# Altium project Ajax_Project_1.PrjPcb
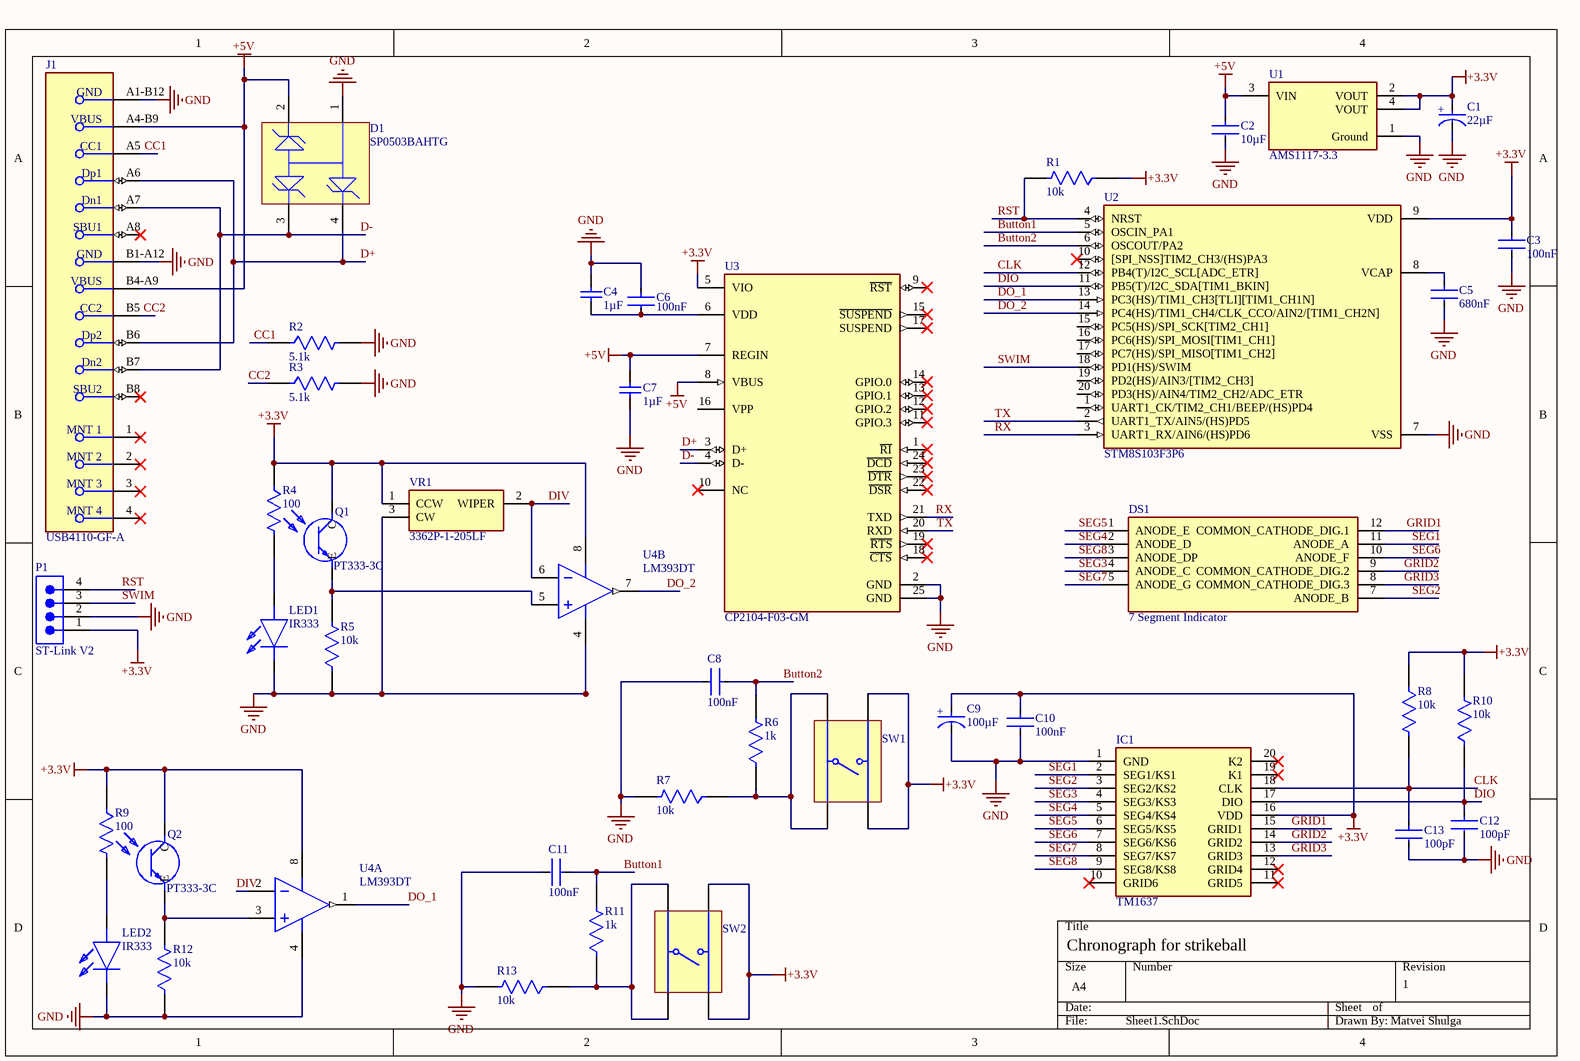
[diagram p0: Sheet1.SchDoc]
1 sheet, 42 parts. Net scope: global (net labels, ports and power ports of the same name join across sheets).

## Sheet Sheet1.SchDoc: Chronograph for strikeball
size A4; Author: Matvei Shulga; Revision: 1; SheetNumber: 1; SheetTotal: 1; SPICEModelCacheOPLTHHRQ: <root> / <DocumentId>OPLTHHRQ</DocumentId> / <CacheFrame Number="0"> / <Model Name="umk316b7104_lht" Kind="CKT"> / <Text>* UMK316B7104_LHT     SPICE MODEL  ( General Type ) / *-------------------------------------------------------------------------------------------------------- / * Model Generated by TAIYO YUDEN Corporation (http://www.ty-top.com) / * Version 1.0 / * TAIYO YUDEN Control No. 170508_121019 / * Copyright(c) 2012 TAIYO YUDEN CO.,LTD. All Rights Reserved. / *-------------------------------------------------------------------------------------------------------- / * / * Products Name : Multilayer Ceramic Capacitors / * / * Characteristics : / *     Capacitance : 0.1 uF , Rated Voltage : 50V , TCC : X7R / *     Case Size : 3.2 x 1.6 / 0.126 x 0.063 [mm/inch] , Thickness : 1.6 / 0.063 [mm/inch] / *     (Conditions: Temperature = 25 degC , DC Bias Current/Voltage = 0A / 0V) / * / * Frequency Range : 40Hz - 3GHz / * / * External Node Assignments : / * / *  1  o---| |---o  2 / * / *-------------------------------------------------------------------------------------------------------- / .SubCkt UMK316B7104_LHT 1 2 / **************************** / C0 1 110 0.095206u / Cm 1 101 4052.8p / C1 101 102 0.015152u / Rc1 101 102 38.136k / C2 102 103 7011.9p / Rc2 102 103 4.5152k / C3 103 110 480.27p / Rc3 103 110 77.842 / C2m 1 301 4187.2p / C21 301 302 0.037007u / Rc21 301 302 210.34k / C22 302 303 0.028314u / Rc22 302 303 194.19k / C23 303 304 0.033221u / Rc23 303 304 121.23k / C24 304 305 0.030298u / Rc24 304 305 5.1398k / C25 305 306 0.022988u / Rc25 305 306 6.4469k / C26 306 307 8382.9p / Rc26 306 307 701.92 / C27 307 308 0.010675u / Rc27 307 308 133.48 / C28 308 309 865.4p / Rc28 308 309 446.19 / C29 309 110 51.562p / Rc29 309 110 115.35 / Rp0 1 110 1G / L0 110 120 0.37263n / Lm 120 130 0.29412n / RL1 120 130 391.15 / L2 120 122 1.582n / RL2 122 130 1.4748 / L3 120 123 2.0038n / RL3 123 130 1.8577 / CR 120 124 0.013158u / LR 124 125 0.41019n / RR 125 130 0.23132 / CL 130 140 10.1p / LL 130 140 0.27868n / RL 130 140 9.6624 / Rs 140 2 17.436m / **************************** / .ends UMK316B7104_LHT</Text> / </Model> / </CacheFrame> / </root>

### Parts
C1  value 22µF  [FP-TAJA-MFG]  (hidden comment: TAJA226M010RNJ)
C2  value 10µF  [FP-GCJ31C-0_4-IPC_C]  (hidden comment: GCJ31CD7YA106KE02L)
C3  value 100nF  [FP-1206-L_3_2_0_15-W_1_6-IPC_B]  (hidden comment: UMK316B7104KLHT)
C4  value 1µF  [CAPC1206(3216)130_M]  (hidden comment: 1206ZC105JAT2A)
C5  value 680nF  [FP-CC0805-0_85-IPC_A]  (hidden comment: CC0805KKX7R6BB684)
C6  value 100nF  [FP-1206-L_3_2_0_15-W_1_6-IPC_B]  (hidden comment: UMK316B7104KLHT)
C7  value 1µF  [CAPC1206(3216)130_M]  (hidden comment: 1206ZC105JAT2A)
C8  value 100nF  [FP-1206-L_3_2_0_15-W_1_6-IPC_B]  (hidden comment: UMK316B7104KLHT)
C9  value 100µF  [FP-TLJA-MFG]  (hidden comment: TLJA107M006R0500)
C10  value 100nF  [FP-1206-L_3_2_0_15-W_1_6-IPC_B]  (hidden comment: UMK316B7104KLHT)
C11  value 100nF  [FP-1206-L_3_2_0_15-W_1_6-IPC_B]  (hidden comment: UMK316B7104KLHT)
C12  value 100pF  [FP-1206-L_3_2_0_2-W_1_6_0-IPC_A]  (hidden comment: 12063A101KAT2A)
C13  value 100pF  [FP-1206-L_3_2_0_2-W_1_6_0-IPC_A]  (hidden comment: 12063A101KAT2A)
D1  SP0503BAHTG  [LFUS-SOT143-4_V]
DS1  7 Segment Indicator  [ELT315USOWAS530A3]
IC1  TM1637  [SOIC127P1045X280-20N]
J1  USB4110-GF-A  [FP-USB4110-GF-A-MFG]
LED1  IR333  [IR333H0A]
LED2  IR333  [IR333H0A]
P1  ST-Link V2  [61300411021]
Q1  PT333-3C  [PT3333C]
Q2  PT333-3C  [PT3333C]
R1  value 10k  [FP-AC1206-IPC_A]  (hidden comment: AC1206FR-1310KL)
R2  value 5.1k  [FP-ESR18-IPC_A]  (hidden comment: ESR18EZPF5101)
R3  value 5.1k  [FP-ESR18-IPC_A]  (hidden comment: ESR18EZPF5101)
R4  value 100  [FP-RC3216-IPC_B]  (hidden comment: RC3216J101CS)
R5  value 10k  [FP-AC1206-IPC_A]  (hidden comment: AC1206FR-1310KL)
R6  value 1k  [FP-RP732B-MFG]  (hidden comment: RP73D2B1K0BTG)
R7  value 10k  [FP-AC1206-IPC_A]  (hidden comment: AC1206FR-1310KL)
R8  value 10k  [FP-AC1206-IPC_A]  (hidden comment: AC1206FR-1310KL)
R9  value 100  [FP-RC3216-IPC_B]  (hidden comment: RC3216J101CS)
R10  value 10k  [FP-AC1206-IPC_A]  (hidden comment: AC1206FR-1310KL)
R11  value 1k  [FP-RP732B-MFG]  (hidden comment: RP73D2B1K0BTG)
R12  value 10k  [FP-AC1206-IPC_A]  (hidden comment: AC1206FR-1310KL)
R13  value 10k  [FP-AC1206-IPC_A]  (hidden comment: AC1206FR-1310KL)
SW1  FSM4JSMATR  [TECO-FSM4JSMATR_V]  (value not drawn)
SW2  FSM4JSMATR  [TECO-FSM4JSMATR_V]  (value not drawn)
U1  AMS1117-3.3  [FP-AMS1117-IPC_B]
U2  STM8S103F3P6  [SOP65P640X120-20N]
U3  CP2104-F03-GM  [FP-CP2104-F03-GM-MFG]
U4  LM393DT  [STM-SO-8_D_L]  (parts A,B of 2)
VR1  3362P-1-205LF  [3362P1205LF]

### Nets
+3.3V: C1.2(A) C3.1 C9.2(A) C10.1 IC1.16(VDD) P1.1 Q1.2(C) Q2.2(C) R1.1 R4.1 R8.1 R9.1 R10.2 SW1.3 SW1.4 SW2.3 SW2.4 U1.2(VOUT) U1.4(VOUT) U2.9(VDD) U3.5(VIO) U4.8(VCC+) VR1.1(CCW)
+5V: C2.1 C7.2 D1.2 J1.A4-B9(VBUS) J1.B4-A9(VBUS) U1.3(VIN) U3.7(REGIN) U3.8(VBUS)
GND: C1.1(C) C2.2 C3.2 C4.2 C5.2 C6.1 C7.1 C8.2 C9.1(C) C10.2 C11.2 C12.2 C13.2 D1.1 IC1.1(GND) J1.A1-B12(GND) J1.B1-A12(GND) LED1.2(K) LED2.2(K) P1.2 R2.2 R3.2 R5.1 R7.2 R12.1 R13.2 U1.1(Ground) U2.7(VSS) U3.2(GND) U3.25(GND) U4.4(VCC-) VR1.3(CW)
Button1: C11.1 R11.2 U2.5(OSCIN_PA1)
Button2: C8.1 R6.2 U2.6(OSCOUT/PA2)
CC1: J1.A5(CC1) R2.1
CC2: J1.B5(CC2) R3.1
CLK: C13.1 IC1.18(CLK) R8.2 U2.12(PB4(T)/I2C_SCL[ADC_ETR])
D+: D1.4 J1.A6(Dp1) J1.B6(Dp2) U3.3(D+)
D-: D1.3 J1.A7(Dn1) J1.B7(Dn2) U3.4(D-)
DIO: C12.1 IC1.17(DIO) R10.1 U2.11(PB5(T)/I2C_SDA[TIM1_BKIN])
DIV: U4.2(IN1-) U4.6(IN2-) VR1.2(WIPER)
DO_1: U2.13(PC3(HS)/TIM1_CH3[TLI][TIM1_CH1N]) U4.1(OUT1)
DO_2: U2.14(PC4(HS)/TIM1_CH4/CLK_CCO/AIN2/[TIM1_CH2N]) U4.7(OUT2)
GRID1: DS1.12(COMMON_CATHODE_DIG.1) IC1.15(GRID1)
GRID2: DS1.9(COMMON_CATHODE_DIG.2) IC1.14(GRID2)
GRID3: DS1.8(COMMON_CATHODE_DIG.3) IC1.13(GRID3)
RST: P1.4 R1.2 U2.4(NRST)
RX: U2.3(UART1_RX/AIN6/(HS)PD6) U3.21(TXD)
SEG1: DS1.11(ANODE_A) IC1.2(SEG1/KS1)
SEG2: DS1.7(ANODE_B) IC1.3(SEG2/KS2)
SEG3: DS1.4(ANODE_C) IC1.4(SEG3/KS3)
SEG4: DS1.2(ANODE_D) IC1.5(SEG4/KS4)
SEG5: DS1.1(ANODE_E) IC1.6(SEG5/KS5)
SEG6: DS1.10(ANODE_F) IC1.7(SEG6/KS6)
SEG7: DS1.5(ANODE_G) IC1.8(SEG7/KS7)
SEG8: DS1.3(ANODE_DP) IC1.9(SEG8/KS8)
SWIM: P1.3 U2.18(PD1(HS)/SWIM)
TX: U2.2(UART1_TX/AIN5/(HS)PD5) U3.20(RXD)
NetC4_1: C4.1 C6.2 U3.6(VDD)
NetC5_1: C5.1 U2.8(VCAP)
NetLED1_1: LED1.1(A) R4.2
NetLED2_1: LED2.1(A) R9.2
NetQ1_1: Q1.1(E) R5.2 U4.5(IN2+)
NetQ2_1: Q2.1(E) R12.2 U4.3(IN1+)
NetR6_1: R6.1 R7.1 SW1.1 SW1.2
NetR11_1: R11.1 R13.1 SW2.1 SW2.2

Not connected (* = marked no-connect by the designer): IC1 10(GRID6)* 11(GRID5)* 12(GRID4)* 19(K1)* 20(K2)*; J1 1(MNT_1)* 2(MNT_2)* 3(MNT_3)* 4(MNT_4)* A8(SBU1)* B8(SBU2)*; U2 1(UART1_CK/TIM2_CH1/BEEP/(HS)PD4) 10([SPI_NSS]TIM2_CH3/(HS)PA3)* 15(PC5(HS)/SPI_SCK[TIM2_CH1]) 16(PC6(HS)/SPI_MOSI[TIM1_CH1]) 17(PC7(HS)/SPI_MISO[TIM1_CH2]) 19(PD2(HS)/AIN3/[TIM2_CH3]) 20(PD3(HS)/AIN4/TIM2_CH2/ADC_ETR); U3 1(~{RI})* 9(~{RST})* 10(NC)* 11(GPIO.3)* 12(GPIO.2)* 13(GPIO.1)* 14(GPIO.0)* 15(~{SUSPEND})* 16(VPP) 17(SUSPEND)* 18(~{CTS})* 19(~{RTS})* 22(~{DSR})* 23(~{DTR})* 24(~{DCD})*

### Notes on the sheet
- (in symbol CMP-001-00089-1) +
- (in symbol CMP-001-00091-1) +

### Library data of the parts
C1 = CMP-001-00089-1: Cap Tant Solid 22uF 10V A CASE 20%( 3.2 X 1.6 X 1.6mm) Inward L SMD 3216-18 3 Ohm 125C T/R; Ripple Current: 63mA; Voltage: 10V; Mounting Technology: Surface Mount; Package: 1206; Pins: 2; Tolerance: 20%; Min Operating Temperature: -55°C; Max Operating Temperature: 125°C
C2 = CMP-001-00085-1: Ceramic Capacitor, Ceramic, 35V, 10% +Tol, 10% -Tol, X7T, 22/-33% TC, 10uF, Surface Mount, 1206; Package: 1206; Mounting Technology: Surface Mount; Min Operating Temperature: -55°C; Voltage: 35V; Max Operating Temperature: 125°C; Tolerance: 10%
C3 C6 C8 C10 C11 = CMP-001-00093-1: Ceramic Capacitor, Multilayer, Ceramic, 50V, 10% +Tol, 10% -Tol, X7R, 15% TC, 0.1uF, Surface Mount, 1206; Pins: 2; Max Operating Temperature: 125°C; RoHS Compliant: Yes; Package: 1206; Capacitor Type: Ceramic; Min Operating Temperature: -55°C; Mounting Technology: Surface Mount
C4 C7 = CMP-001-00084-1: Ceramic Capacitor, Multilayer, Ceramic, 10V, 5% +Tol, 5% -Tol, X7R, 15% TC, 1uF, Surface Mount, 1206; Pins: 2; Mounting Technology: Surface Mount; Min Operating Temperature: -55°C; Package: 1206; Voltage: 10V; Max Operating Temperature: 125°C; Tolerance: 5%
C5 = CMP-001-00094-1: Ceramic Capacitor, Multilayer, Ceramic, 10V, 10% +Tol, 10% -Tol, X7R, 15% TC, 0.68uF, Surface Mount, 0805; Package: 0805; Mounting Technology: Surface Mount; Capacitor Type: Ceramic; Pins: 2; RoHS Compliant: Yes; Max Operating Temperature: 125°C; Min Operating Temperature: -55°C
C9 = CMP-001-00091-1: Cap Tant Solid 100uF 6.3V A CASE 20% (3.2 X 1.6 X 1.6mm) Inward L SMD 3216-18 0.5 Ohm 125C T/R; Ripple Current: 155mA; Mounting Technology: Surface Mount; Package: 1206; Min Operating Temperature: -55°C; Max Operating Temperature: 125°C; Voltage: 6.3V; Tolerance: 20%; Pins: 2
C12 C13 = CMP-001-00096-1: Ceramic Capacitor, Multilayer, Ceramic, 25V, 10% +Tol, 10% -Tol, C0G, 30ppm/Cel TC, 0.0001uF, Surface Mount, 1206; Max Operating Temperature: 125°C; Min Operating Temperature: -55°C; Package: 1206; Pins: 2; Mounting Technology: Surface Mount; RoHS Compliant: Yes; Capacitor Type: Ceramic
D1 = CMP-004-00031-1: SP050xBA Series 8.5 V 30 pF Triple Uni-Directional TVS Avalanche Diode-SOT143-4; Mounting Technology: Surface Mount; Max Operating Temperature: 125°C; Package: SOT-143; Min Operating Temperature: -40°C; Pins: 4
DS1 = ELT-315USOWA_S530-A3: Display; Manufacturer: Everlight; Part Number: ELT-315USOWA/S530-A3; Datasheet Link: https://media.digikey.com/pdf/Data%20Sheets/Everlight%20PDFs/ELT-315USOWA_S530-A3.pdf; Height: 7.45mm
IC1 = TM1637__SOP_: Integrated Circuit; Manufacturer: TITAN MICRO ELECTRONICS; Part Number: TM1637 (SOP); Datasheet Link: https://www.mcielectronics.cl/website_MCI/static/documents/Datasheet_TM1637.pdf; Height: 2.8mm
J1 = CMP-002-00071-1: USB Connector, 16 Contact(s), Male, Right Angle, Surface Mount Terminal, Locking, Receptacle; Voltage: 20V; Pins: 16; Gender: Receptacle; Max Operating Temperature: 85°C; Min Operating Temperature: -40°C
LED1 LED2 = IR333_H0-A: LED; Manufacturer: Everlight; Part Number: IR333/H0-A; Datasheet Link: https://datasheet.lcsc.com/lcsc/1808280419_Everlight-Elec-IR333-H0-A_C264292.pdf; Height: 10.4mm; Mouser Part Number: 638-IR333/H0-A; Mouser Price/Stock: https://www.mouser.co.uk/ProductDetail/Everlight/IR333-H0-A?qs=By6Nw2ByBD39%252BlkBkN%2FobQ%3D%3D
P1 = CMP-007-000000-1: NexarPartId: 31153320; Operating Supply Voltage: 250V; Contact Resistance: 20m?; Gender: Male; Connector Type: Male Pin; Number of Positions: 4; Pitch: 2.54mm; Current Rating: 3A; Mount: Through Hole; Color: Black; REACH SVHC: Unknown; Component Type: Standard; Source: Components - 25.08.25 - 11.48.SchLib; Lead Pitch: 2.54mm; Contact Plating: Gold; Design Item ID: CMP-1502-01063-3; Number of Pins: 4; Contact Material: Copper; Number of Contacts: 4; Termination: Solder; Number of Rows: 1; RoHS: Compliant; Contact Mating Length: 5.9944mm; Pin Count: 4
Q1 Q2 = PT333-3C: Phototransistor; Manufacturer: Everlight; Datasheet Link: https://datasheet.datasheetarchive.com/originals/distributors/Datasheets-3/DSA-51362.pdf; Part Number: PT333-3C; Mouser Part Number: 638-PT3333C; Mouser Price/Stock: https://www.mouser.com/Search/Refine.aspx?Keyword=638-PT3333C; Arrow Part Number: PT333-3C; Arrow Price/Stock: https://www.arrow.com/en/products/pt333-3c/everlight-electronics?region=nac
R1 R5 R7 R8 R10 R12 R13 = CMP-009-00188-1: Res Thick Film 1206 10K Ohm 1% 0.25W(1/4W) ±100ppm/°C Pad SMD T/R Automotive AEC-Q200; Voltage: 200V; Tolerance: 1%; Mounting Technology: Surface Mount; Package: 1206; Max Operating Temperature: 155°C; Min Operating Temperature: -55°C
R2 R3 = CMP-009-00187-1: Res Thick Film 1206 5.1K Ohm 1% 0.5W(1/2W) ±100ppm/C Pad SMD T/R Automotive AEC-Q200; Voltage: 200V; Min Operating Temperature: -55°C; Tolerance: 1%; Mounting Technology: Surface Mount; Max Operating Temperature: 155°C; Package: 1206
R4 R9 = CMP-009-00193-1: Res Thick Film 1206 100 Ohm 5% 1/4W ±100ppm/°C Molded SMD T/R; Voltage: 200V; Tolerance: 5%; Min Operating Temperature: -55°C; Max Operating Temperature: 155°C; Package: 1206; Mounting Technology: Surface Mount
R6 R11 = CMP-009-00192-1: Res Thin Film 1206 1K Ohm 0.1% 0.25W(1/4W) ±15ppm/C Pad SMD Cut Tape Medical; Voltage: 25V; Package: 1206; Mounting Technology: Surface Mount; Min Operating Temperature: -55°C; Max Operating Temperature: 155°C; Pins: 2; Tolerance: 0.1%
SW1 SW2 = CMP-016-00017-1: Keypad Switch, 1 Switches, SPST, Momentary-tactile, 0.05A, 24VDC, 2.06N, Solder Terminal, Surface Mount-straight; Max Operating Temperature: 85°C; Mounting Technology: Surface Mount; Min Operating Temperature: -20°C; RoHS Compliant: Yes
U1 = CMP-019-00049-1: Fixed Positive LDO Regulator, 3.3V, 1.3V Dropout, PDSO3; Pins: 3; Package: SOP; RoHS Compliant: Yes
U2 = CMP-031-00007-3: STM8 series Microcontroller IC 8-Bit 16MHz 8KB (8K x 8) FLASH 20-TSSOP; MF: STMicroelectronics; Value: *; MP: STM8S103F3P6; Check_prices: https://www.snapeda.com/parts/STM8S103F3P6/STMicroelectronics/view-part/?ref=eda; SnapEDA_Link: https://www.snapeda.com/parts/STM8S103F3P6/STMicroelectronics/view-part/?ref=snap; Design Item ID: STM8S103F3P6; Source: STM8S103F3P6.SchLib; Pins: 20; Package: TSSOP-20 STMicroelectronics; Component Type: Standard
U3 = CMP-015-00008-1: USB-to-UART 1-CH 576byte FIFO 3.3V Automotive 24-Pin QFN EP Tube; Max Supply Voltage: 3.6V; Min Supply Voltage: 3V; Min Operating Temperature: -40°C; Max Operating Temperature: 85°C; Package: QFN; Pins: 24
U4 = CMP-016-00016-1: Comparator, 2 Func, 9000uV Offset-Max, 1300ns Response Time, BIPolar, PDSO8; Nominal Supply Voltage: 5V; Min Operating Temperature: 0°C; Package: SOP; Max Operating Temperature: 70°C; RoHS Compliant: Yes; Pins: 8
VR1 = 3362P-1-205LF: Variable Resistor; Manufacturer: Bourns; Datasheet Link: https://www.bourns.com/docs/Product-Datasheets/3362.pdf; Height: 5.13mm; Part Number: 3362P-1-205LF; Mouser Part Number: 652-3362P-1-205LF; Mouser Price/Stock: https://www.mouser.co.uk/ProductDetail/Bourns/3362P-1-205LF?qs=nRMFw3K2t64w844%2Fcd92TA%3D%3D; Arrow Part Number: 3362P-1-205LF; Arrow Price/Stock: https://www.arrow.com/en/products/3362p-1-205lf/bourns?region=nac